# EAGLE design cpu adapter (EAGLE 9.4.2)
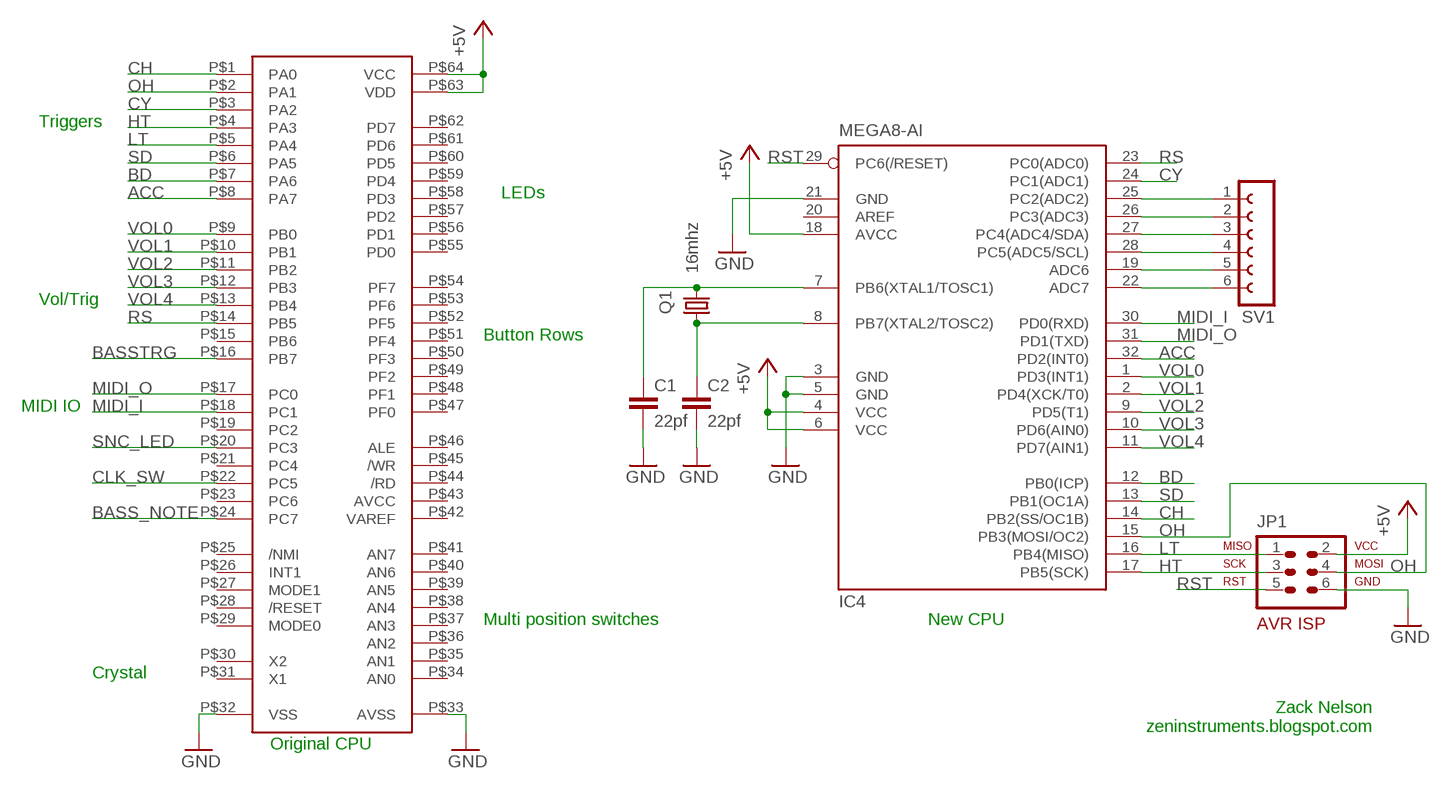
[diagram p0: schematic, sheet 1]

## Parts
C1  22pf  C-EU025-024X044  [C025-024X044]
C2  22pf  C-EU025-024X044  [C025-024X044]
IC1  D7811G  [64STAG]
IC4  MEGA8-AI  [TQFP32-08]
JP1  AVR-ISP-6  AVR-ISP-6VERT  [AVR-ISP-6]
Q1  16mhz  CRYSTALHC18U-V  [HC18U-V]
SV1  FE06-1  [FE06]

## Nets
+5V [power]: IC1.P$63(VDD) IC1.P$64(VCC) IC4.4(VCC) IC4.6(VCC) IC4.18(AVCC) JP1.2
ACC: IC1.P$8(PA7) IC4.32(PD2(INT0))
BASS_NOTE: IC1.P$24(PC7)
BASSTRG: IC1.P$16(PB7)
BD: IC1.P$7(PA6) IC4.12(PB0(ICP))
CH: IC1.P$1(PA0) IC4.14(PB2(SS/OC1B))
CLK_SW: IC1.P$22(PC5)
CY: IC1.P$3(PA2) IC4.24(PC1(ADC1))
GND [power]: C1.2 C2.2 IC1.P$32(VSS) IC1.P$33(AVSS) IC4.3(GND) IC4.5(GND) IC4.21(GND) JP1.6
HT: IC1.P$4(PA3) IC4.17(PB5(SCK)) JP1.3
LB: IC4.27(PC4(ADC4/SDA)) SV1.3
LT: IC1.P$5(PA4) IC4.16(PB4(MISO)) JP1.1
MB: IC4.19(ADC6) SV1.5
MIDI_I: IC1.P$18(PC1) IC4.30(PD0(RXD))
MIDI_O: IC1.P$17(PC0) IC4.31(PD1(TXD))
N$1: IC4.22(ADC7) SV1.6
N$2: C1.1 IC4.7(PB6(XTAL1/TOSC1)) Q1.2
N$3: C2.1 IC4.8(PB7(XTAL2/TOSC2)) Q1.1
OH: IC1.P$2(PA1) IC4.15(PB3(MOSI/OC2)) JP1.4
RB: IC4.28(PC5(ADC5/SCL)) SV1.4
RS: IC1.P$14(PB5) IC4.23(PC0(ADC0))
RST: IC4.29(PC6(/RESET)) JP1.5
SD: IC1.P$6(PA5) IC4.13(PB1(OC1A))
SNC_LED: IC1.P$20(PC3)
VOL0: IC1.P$9(PB0) IC4.1(PD3(INT1))
VOL1: IC1.P$10(PB1) IC4.2(PD4(XCK/T0))
VOL2: IC1.P$11(PB2) IC4.9(PD5(T1))
VOL3: IC1.P$12(PB3) IC4.10(PD6(AIN0))
VOL4: IC1.P$13(PB4) IC4.11(PD7(AIN1))
YA: IC4.25(PC2(ADC2)) SV1.1
YB: IC4.26(PC3(ADC3)) SV1.2
Unconnected: IC1.P$15(PB6) IC1.P$19(PC2) IC1.P$21(PC4) IC1.P$23(PC6) IC1.P$25(/NMI) IC1.P$26(INT1) IC1.P$27(MODE1) IC1.P$28(/RESET) IC1.P$29(MODE0) IC1.P$30(X2) IC1.P$31(X1) IC1.P$34(AN0) IC1.P$35(AN1) IC1.P$36(AN2) IC1.P$37(AN3) IC1.P$38(AN4) IC1.P$39(AN5) IC1.P$40(AN6) IC1.P$41(AN7) IC1.P$42(VAREF) IC1.P$43(AVCC) IC1.P$44(/RD) IC1.P$45(/WR) IC1.P$46(ALE) IC1.P$47(PF0) IC1.P$48(PF1) IC1.P$49(PF2) IC1.P$50(PF3) IC1.P$51(PF4) IC1.P$52(PF5) IC1.P$53(PF6) IC1.P$54(PF7) IC1.P$55(PD0) IC1.P$56(PD1) IC1.P$57(PD2) IC1.P$58(PD3) IC1.P$59(PD4) IC1.P$60(PD5) IC1.P$61(PD6) IC1.P$62(PD7) IC4.20(AREF)

## Notes on the sheet
- Triggers
- LEDs
- Vol/Trig
- Button Rows
- MIDI IO
- Multi position switches | New CPU
- Crystal
- Zack Nelson
  zeninstruments.blogspot.com
- Original CPU

## Library data of the parts
C1 C2 = rcl:C-EU: CAPACITOR, European symbol
IC1 = D7811G:D7811G
IC4 = atmel:MEGA8: MICROCONTROLLER 8 Kbytes FLASH, 1 kbytes SRAM, 512 bytes EEPROM, USART, 6-channel 10 bit ADC, 2-channel 8 bit ADC Pin compatible with Atmega48, ATMega88, ATMega168 Source: avr.lbr; MPN: ATMEGA8-16AU; OC_FARNELL: 9171371; OC_NEWARK: 73M8863
JP1 = avr-7:AVR-ISP-6: AVR ISP-6 Serial Programming Header
Q1 = crystal:CRYSTAL: CRYSTAL; OC_FARNELL: unknown; OC_NEWARK: unknown
SV1 = con-lsta:FE06-1: FEMALE HEADER; OC_FARNELL: unknown; OC_NEWARK: unknown

## Net classes
1 power: width 0.508 mm

## Board
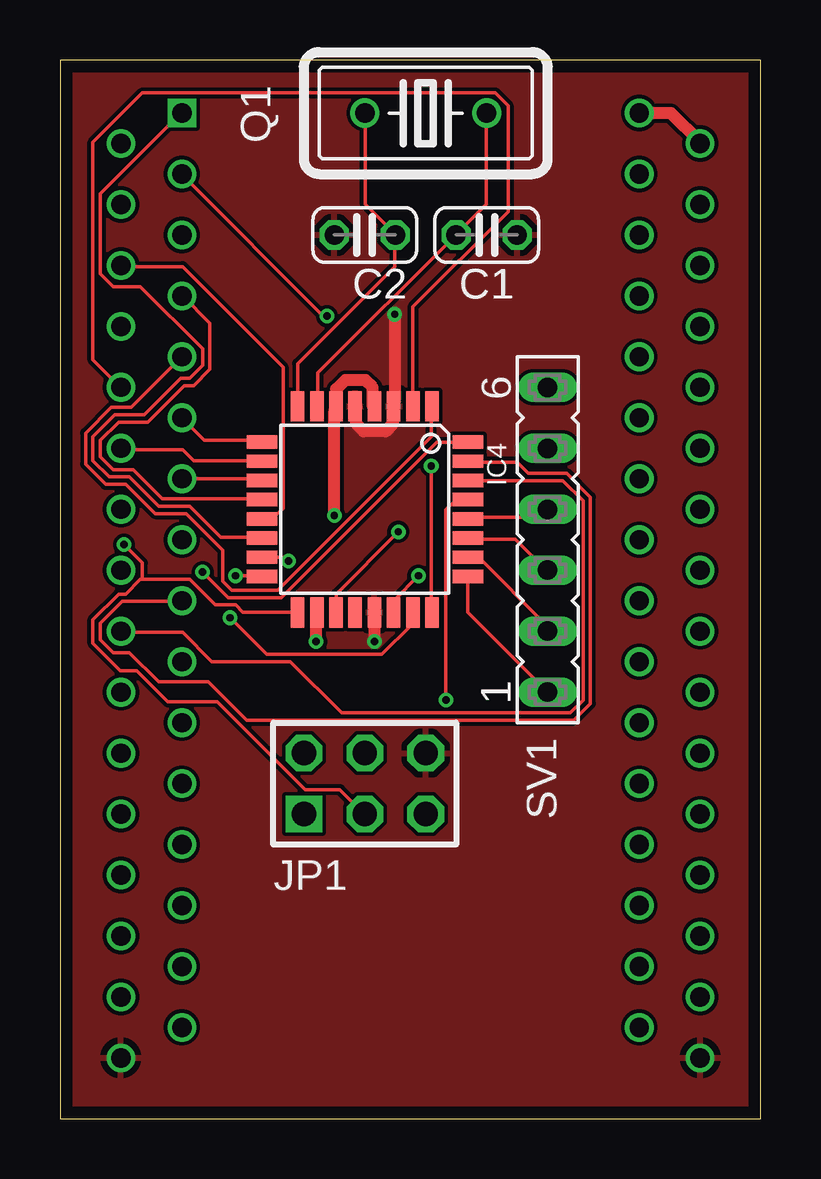
[diagram p1: board, top side]
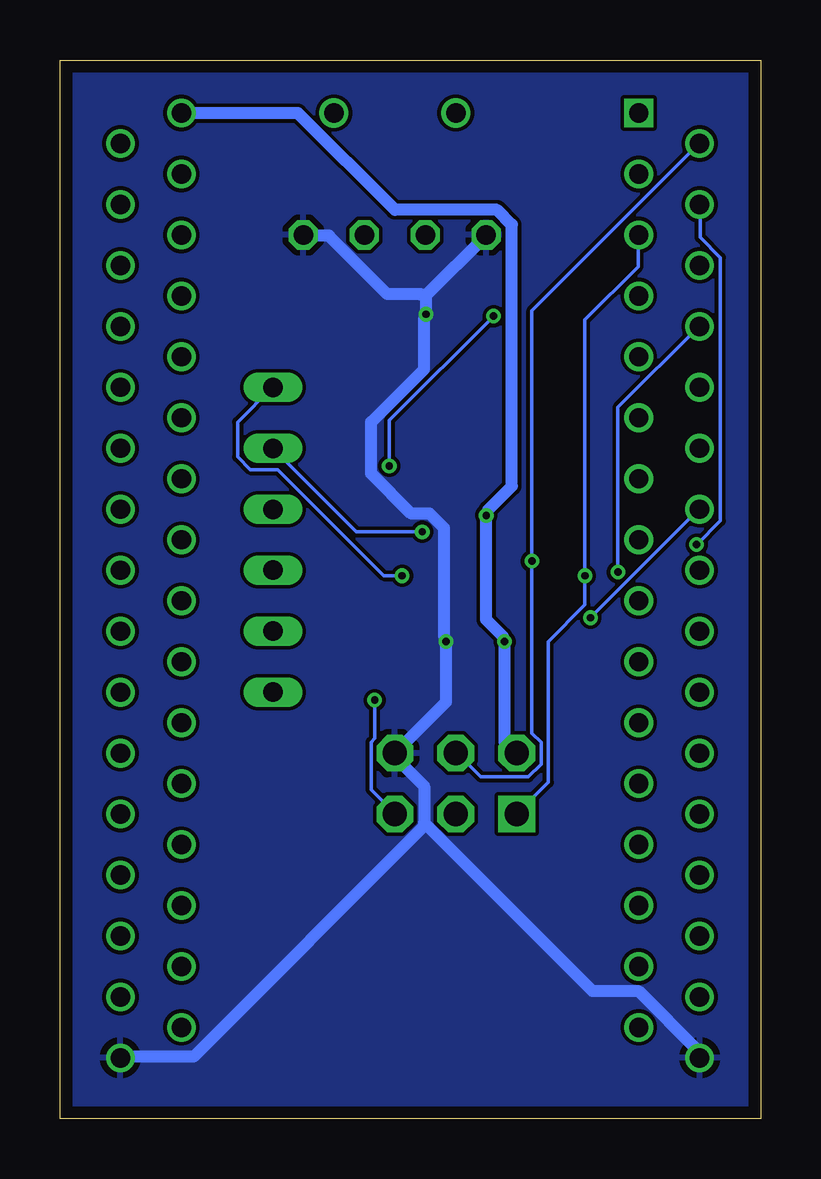
[diagram p2: board, bottom side, seen from below]

Size 29.19 x 44.12 mm. Coordinates in mm from the lower left corner, seen from the top.
Outline: 0,0 29.19,0 29.19,44.12 0,44.12 0,0
Copper layers (1*16): Top 0.035mm / dielectric 1.6mm / Bottom 0.035mm
Design rules "Elecrow_2-layer_PCB_eagle_rule": minimum track width 6mil, minimum drill 12mil, track to track 6mil, track to pad 6mil, pad to pad 6mil, via to via 8mil, smd to smd 0mil, copper to edge 20mil, drill to drill 10mil, minimum pad ring 6mil, minimum via ring 6mil, stop-mask expansion 0mil, vias tented up to drill 100mil, thermal gap 10mil

### Footprints (pad centres in the part's own frame; a part is rotated, then mirrored left to right if it is on the bottom)
C025-024X044 = drill 0.813 octagon: 1 -1.27,0; 2 1.27,0
64STAG = drill 0.8 square: P$1 -8.89,19.05 | drill 0.8: P$2 -11.43,17.78; P$3 -8.89,16.51; P$4 -11.43,15.24; P$5 -8.89,13.97; P$6 -11.43,12.7; P$7 -8.89,11.43; P$8 -11.43,10.16; P$9 -8.89,8.89; P$10 -11.43,7.62; P$11 -8.89,6.35; P$12 -11.43,5.08; P$13 -8.89,3.81; P$14 -11.43,2.54; P$15 -8.89,1.27; P$16 -11.43,0; P$17 -8.89,-1.27; P$18 -11.43,-2.54; P$19 -8.89,-3.81; P$20 -11.43,-5.08; P$21 -8.89,-6.35; P$22 -11.43,-7.62; P$23 -8.89,-8.89; P$24 -11.43,-10.16; P$25 -8.89,-11.43; P$26 -11.43,-12.7; P$27 -8.89,-13.97; P$28 -11.43,-15.24; P$29 -8.89,-16.51; P$30 -11.43,-17.78; P$31 -8.89,-19.05; P$32 -11.43,-20.32; P$33 12.7,-20.32; P$34 10.16,-19.05; P$35 12.7,-17.78; P$36 10.16,-16.51; P$37 12.7,-15.24; P$38 10.16,-13.97; P$39 12.7,-12.7; P$40 10.16,-11.43; P$41 12.7,-10.16; P$42 10.16,-8.89; P$43 12.7,-7.62; P$44 10.16,-6.35; P$45 12.7,-5.08; P$46 10.16,-3.81; P$47 12.7,-2.54; P$48 10.16,-1.27; P$49 12.7,0; P$50 10.16,1.27; P$51 12.7,2.54; P$52 10.16,3.81; P$53 12.7,5.08; P$54 10.16,6.35; P$55 12.7,7.62; P$56 10.16,8.89; P$57 12.7,10.16; P$58 10.16,11.43; P$59 12.7,12.7; P$60 10.16,13.97; P$61 12.7,15.24; P$62 10.16,16.51; P$63 12.7,17.78; P$64 10.16,19.05
TQFP32-08 = smd 1.27 x 0.559: 1 -4.293,2.8; 2 -4.293,2; 3 -4.293,1.2; 4 -4.293,0.4; 5 -4.293,-0.4; 6 -4.293,-1.2; 7 -4.293,-2; 8 -4.293,-2.8; 17 4.293,-2.8; 18 4.293,-2; 19 4.293,-1.2; 20 4.293,-0.4; 21 4.293,0.4; 22 4.293,1.2; 23 4.293,2; 24 4.293,2.8 | smd 0.559 x 1.27: 9 -2.8,-4.293; 10 -2,-4.293; 11 -1.2,-4.293; 12 -0.4,-4.293; 13 0.4,-4.293; 14 1.2,-4.293; 15 2,-4.293; 16 2.8,-4.293; 25 2.8,4.293; 26 2,4.293; 27 1.2,4.293; 28 0.4,4.293; 29 -0.4,4.293; 30 -1.2,4.293; 31 -2,4.293; 32 -2.8,4.293
AVR-ISP-6 = drill 1.016 square: 1 -2.54,-1.27 | drill 1.016 octagon: 2 -2.54,1.27; 3 0,-1.27; 4 0,1.27; 5 2.54,-1.27; 6 2.54,1.27
HC18U-V = drill 0.813: 1 -2.54,0; 2 2.54,0
FE06 = drill 0.813 long: 1 -6.35,0; 2 -3.81,0; 3 -1.27,0; 4 1.27,0; 5 3.81,0; 6 6.35,0

### Placement (x,y rotation side)
C1  17.78,36.83 0 top
C2  12.7,36.83 180 top
IC1  13.97,22.86 0 top
IC4  12.7,25.4 270 top
JP1  12.7,13.97 0 top
Q1  15.24,41.91 0 top
SV1  20.32,24.13 90 top

### Tracks (layer width: path | path; a pad name or v marks a point on that pad's centre or on a via)
+5V  (via drill 0.3)
  Top 0.508: IC1.P$64 25.45,41.91 26.67,40.69 IC1.P$63 | IC4.4 13.03,29.72 13.03,30.48 12.72,30.79 11.89,30.79 11.51,30.4 11.51,29.72 IC4.6 11.43,29.49 v11.43,25.15 | v10.67,19.89 10.67,21.11 IC4.18
  Bottom 0.508: JP1.2 10.21,15.24 10.67,15.7 v10.67,19.89 10.74,20.12 11.43,20.8 v11.43,25.15 11.35,25.38 10.36,26.36 10.36,37.26 10.97,37.87 15.24,37.87 19.28,41.91 IC1.P$64
ACC  (via drill 0.3)
  Top 0.152: v5.94,22.78 7.01,21.72 9.22,21.72 15.7,28.19 IC4.32
  Bottom 0.152: v5.94,22.78 5.94,29.64 2.59,32.99 IC1.P$8
BD
  Top 0.152: IC4.12 8.38,25.83 4.27,25.83 3.05,27.05 2.21,27.05 1.68,27.58 1.68,28.27 2.44,29.03 3.66,29.03 5.18,30.56 5.56,30.56 6.25,31.24 6.25,33.15 5.11,34.29 IC1.P$7
CH
  Top 0.152: IC4.14 8.38,24.23 6.71,24.23 5.41,25.53 4.12,25.53 2.9,26.75 2.06,26.75 1.37,27.43 1.37,28.42 2.29,29.34 3.5,29.34 5.03,30.86 5.41,30.86 5.94,31.39 5.94,32.08 3.35,34.67 2.21,34.67 1.68,35.2 1.68,38.56 5.03,41.91 IC1.P$1
CY  (via drill 0.3)
  Top 0.152: v15.47,27.2 15.47,21.11 IC4.24 | v11.12,33.45 10.97,33.45 5.11,39.32 IC1.P$3
  Bottom 0.152: v15.47,27.2 15.47,29.11 v11.12,33.45
GND  (via drill 0.3)
  Top 0.508: IC4.5 12.34,29.64 12.34,28.96 12.65,28.65 13.56,28.65 13.87,28.96 13.87,29.64 IC4.3 13.95,29.95 v13.95,33.53 | v13.11,19.89 IC4.21
  Bottom 0.508: 13.95,34.29 v13.95,33.53 14.02,33.3 14.02,31.24 16.23,29.03 16.23,26.9 14.55,25.22 13.79,25.22 13.18,24.61 13.18,20.12 v13.11,19.89 13.11,17.37 JP1.6 15.16,15.01 14.02,13.87 14.02,12.34 13.95,12.27 | 13.95,34.29 11.43,36.8 C2.2 | C1.2 19.05,36.8 17.98,36.8 15.54,34.37 14.17,34.37 13.95,34.29 | 13.95,12.27 7.01,5.33 5.11,5.33 2.59,2.82 2.59,2.59 IC1.P$32 | 13.95,12.27 23.62,2.59 26.67,2.59 IC1.P$33
  pour Bottom: 0,0 30.48,0 30.48,45.72 0,45.72
  pour Top: 0,0 29.21,0 29.21,46.99 0,46.99
HT  (via drill 0.3)
  Top 0.152: IC4.17 7.62,21.11 7.32,21.41 6.48,21.41 5.41,22.48 3.43,22.48 | 3.43,22.48 3.35,22.48 2.74,21.87 2.44,21.87 1.37,20.8 1.37,19.81 2.52,18.67 3.2,18.67 4.5,17.37 6.55,17.37 10.21,13.72 11.66,13.72 12.65,12.72 JP1.3 | v2.67,23.93 3.43,23.16 3.43,22.48
  Bottom 0.152: v2.67,23.93 1.68,24.92 1.68,35.89 2.52,36.73 2.52,38.1 IC1.P$4
LB
  Top 0.152: IC4.27 16.99,24.16 18.97,24.16 20.27,22.86 SV1.3
LT  (via drill 0.3)
  Top 0.152: v7.32,22.63 8.38,22.63 IC4.16
  Bottom 0.152: JP1.1 8.84,14.02 8.84,19.89 7.32,21.41 v7.32,22.63 7.32,33.3 5.11,35.51 5.11,36.8 IC1.P$5
MB  (via drill 0.3)
  Top 0.152: IC4.19 11.51,21.87 v14.1,24.46
  Top 0.508: IC4.19
  Bottom 0.152: v14.1,24.46 16.84,24.46 SV1.5
MIDI_I
  Top 0.152: IC4.30 20.95,26.59 21.79,25.76 21.79,17.45 21.26,16.92 11.73,16.92 9.6,19.05 6.33,19.05 5.11,20.27 2.59,20.27 IC1.P$18
MIDI_O
  Top 0.152: IC4.31 16.99,27.36 19.05,27.36 19.51,26.9 21.11,26.9 22.1,25.91 22.1,17.3 21.41,16.61 7.77,16.61 6.17,18.21 4.12,18.21 2.9,19.43 2.21,19.43 1.68,19.96 1.68,20.65 2.59,21.57 5.03,21.57 IC1.P$17
N$1  (via drill 0.3)
  Top 0.152: v14.94,22.63 13.95,21.64 13.95,21.11 IC4.22
  Bottom 0.152: v14.94,22.63 15.7,22.63 20.12,27.05 21.26,27.05 21.79,27.58 21.79,29.03 20.34,30.48 SV1.6
N$2
  Top 0.152: IC4.7 10.74,29.72 10.74,31.09 16.46,36.8 C1.1 16.54,36.88 17.75,38.1 17.75,41.91 Q1.2
N$3
  Top 0.152: IC4.8 9.91,29.72 9.91,31.47 13.95,35.51 13.95,36.8 C2.1 13.95,36.88 12.72,38.1 12.72,41.91 Q1.1
OH  (via drill 0.3)
  Top 0.152: v9.53,23.24 9.37,23.39 8.46,23.39 IC4.15
  Bottom 0.152: JP1.4 12.65,15.24 11.66,14.25 9.68,14.25 9.14,14.78 9.14,15.7 9.53,16.08 v9.53,23.24 9.53,33.68 2.59,40.62 IC1.P$2
RB
  Top 0.152: IC4.28 16.99,25.07 19.96,25.07 20.27,25.38 SV1.4
RS  (via drill 0.3)
  Top 0.152: v7.09,20.88 8.61,19.36 13.41,19.36 14.63,20.57 14.63,21.11 IC4.23
  Bottom 0.152: v7.09,20.88 2.59,25.38 IC1.P$14
RST  (via drill 0.3)
  Top 0.152: v16.08,17.45 16.08,25.38 16.46,25.76 16.99,25.76 IC4.29
  Bottom 0.152: v16.08,17.45 16.08,15.85 16.23,15.7 16.23,13.72 15.24,12.72 JP1.5
SD
  Top 0.152: IC4.13 8.46,25.07 8.91,25.07 9.3,25.45 9.3,31.32 5.11,35.51 2.59,35.51 IC1.P$6
VOL0
  Top 0.152: IC1.P$9 2.97,29.64 2.13,29.64 1.07,28.57 1.07,27.28 1.91,26.44 2.74,26.44 3.96,25.22 5.26,25.22 6.78,23.7 6.78,22.4 7.16,22.02 9.07,22.02 15.47,28.42 15.47,29.64 IC4.1
VOL1
  Top 0.152: IC4.2 14.71,29.72 14.71,33.83 18.67,37.8 18.67,42.22 18.14,42.75 3.43,42.75 1.37,40.69 1.37,31.62 2.52,30.48 IC1.P$10
VOL2
  Top 0.152: IC1.P$11 6.02,28.27 8.38,28.27 IC4.9
VOL3
  Top 0.152: IC4.10 8.38,27.43 5.56,27.43 5.11,27.89 2.59,27.89 IC1.P$12
VOL4
  Top 0.152: IC1.P$13 8.38,26.67 IC4.11
YA
  Top 0.152: IC4.25 16.99,21.11 SV1.1
YB
  Top 0.152: IC4.26 17.45,23.39 20.27,20.57 20.27,20.34 SV1.2